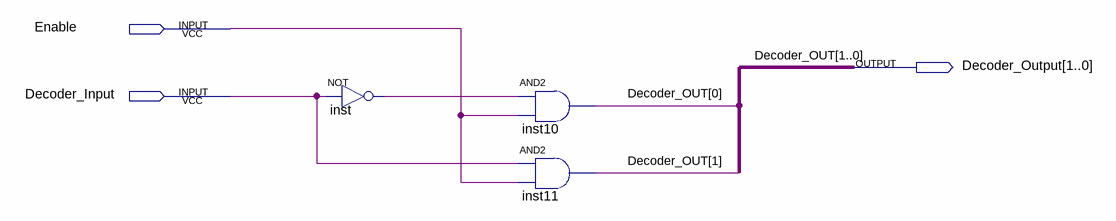
[diagram p0: schematic sheet]
// Quartus schematic 1to2DecoderWithEnable.bdf as structural Verilog: 3 symbols, 3 pins
module \1to2DecoderWithEnable  (
  input  Enable,
  input  Decoder_Input,
  output [1:0] Decoder_Output
);

  wire inst_out;

  not inst (inst_out, Decoder_Input);
  and inst10 (Decoder_Output[0], inst_out, Enable);
  and inst11 (Decoder_Output[1], Decoder_Input, Enable);

  // Other names for the same wires on the sheet: Decoder_OUT[1:0] = Decoder_Output
endmodule
